# Altium schematic sheet F030K6T6.schdoc
size 309 x 223 mm; Symbol: Sheet-Symbol_A4; Device: Sheet-Symbol_A4; Convert to PCB: yes; Add into BOM: yes; Drawed: timp2100; Reviewed: timp2100; Version: 1.0; @Project Name: F030K6T6; @Page Count: 1; @Update Date: 2022-08-12; @Create Date: 2022-07-31; @Schematic Name: Schematic1; @Page No: 1; @Page Name: P1
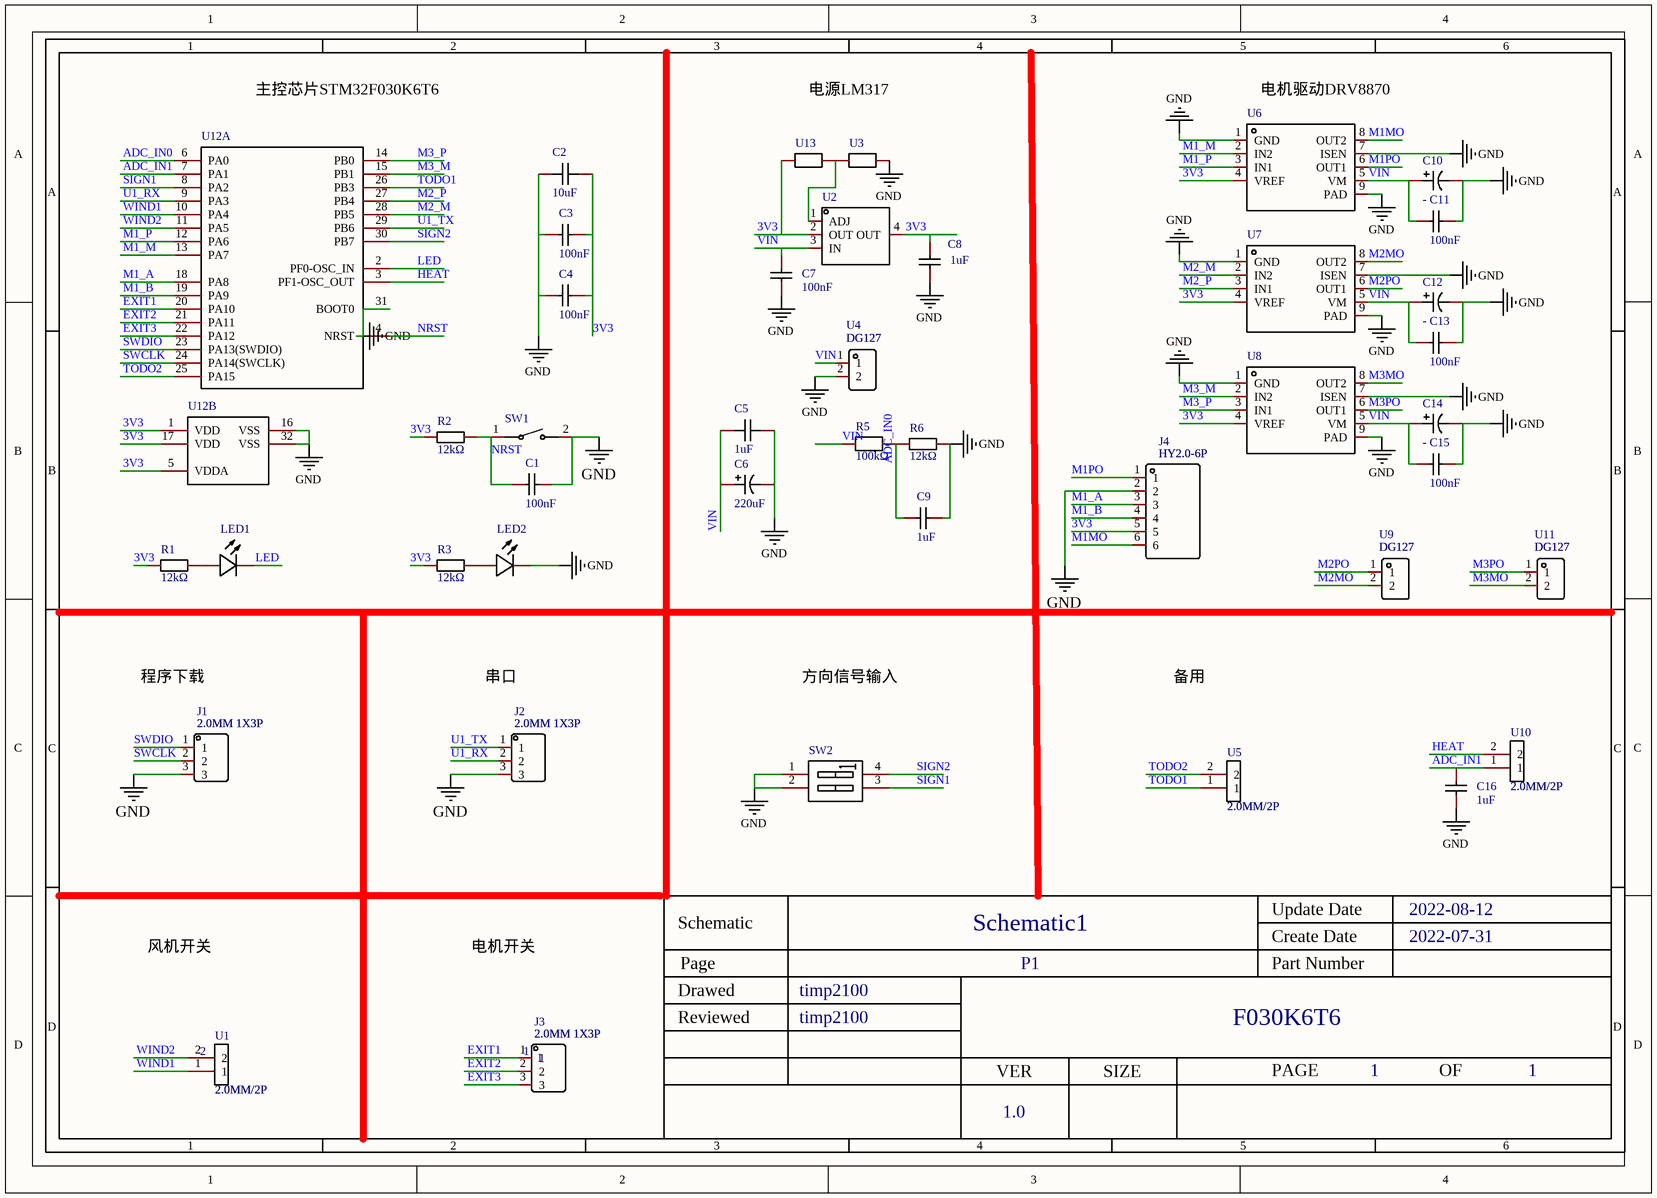
[diagram p0: F030K6T6.schdoc]

## Parts
C1  value 100nF  [C0402]  (hidden comment: 0402F104M500NT)
C2  value 10uF  [C0402]  (hidden comment: GRJ155R60J106ME11D)
C3  value 100nF  [C0402]  (hidden comment: 0402F104M500NT)
C4  value 100nF  [C0402]  (hidden comment: 0402F104M500NT)
C5  value 1uF  [C0603]  (hidden comment: GRT188R61H105KE13D)
C6  value 220uF  [CAP-SMD_BD10.0-L10.3-W10.3-LS11.0-FD]  (hidden comment: RVT220UF50V67RV0021)
C7  value 100nF  [C0402]  (hidden comment: 0402F104M500NT)
C8  value 1uF  [C0402]  (hidden comment: LMK105BJ105KV-F)
C9  value 1uF  [C0402]  (hidden comment: LMK105BJ105KV-F)
C10  XT47UF50V90RV0082  [CAP-SMD_BD6.3-L6.6-W6.6-LS7.3-FD]  (value not drawn)
C11  value 100nF  [C0402]  (hidden comment: 0402F104M500NT)
C12  XT47UF50V90RV0082  [CAP-SMD_BD6.3-L6.6-W6.6-LS7.3-FD]  (value not drawn)
C13  value 100nF  [C0402]  (hidden comment: 0402F104M500NT)
C14  XT47UF50V90RV0082  [CAP-SMD_BD6.3-L6.6-W6.6-LS7.3-FD]  (value not drawn)
C15  value 100nF  [C0402]  (hidden comment: 0402F104M500NT)
C16  value 1uF  [C0402]  (hidden comment: LMK105BJ105KV-F)
J1  2.0MM 1X3P  [2.0MM-1X3P]
J2  2.0MM 1X3P  [2.0MM-1X3P]
J3  2.0MM 1X3P  NAME: 1  [2.0MM-1X3P]
J4  HY2.0-6P  [HY2.0-6P]
LED1  MHT136CRCT  [LED0402-RD]  (value not drawn)
LED2  MHT136CGCT  [LED0402-RD_GREEN]  (value not drawn)
R1  value 12kΩ  [R0402]  (hidden comment: 0402WGJ0123TCE)
R2  value 12kΩ  [R0402]  (hidden comment: 0402WGJ0123TCE)
R3  value 12kΩ  [R0402]  (hidden comment: 0402WGJ0123TCE)
R5  value 100kΩ  [R0402]  (hidden comment: RT0402CRE07100KL)
R6  value 12kΩ  [R0402]  (hidden comment: 0402WGJ0123TCE)
SW1  K2-1107ST-A4DW-06  [KEY-SMD_L6.2-W3.6-LS8.0]  (value not drawn)
SW2  DS-02RP  [SW-TH_DS-02XP]  (value not drawn)
U1  2.0MM/2P  NUMBER: 2  [2.0MM/1*2P]
U2  LM317  [SOT-223-3_L6.5-W3.4-P2.30-LS7.0-BR]  (value not drawn)
U3  SCR0402J20K  [R0402]  (value not drawn)
U4  DG127  [CONN-TH_DG127-5.0-02P-14-1002A-H]
U5  2.0MM/2P  [2.0MM/1*2P]
U6  DRV8870DDAR  [HSOP-8_L5.0-W4.0-P1.27-LS6.2-BL-EP]  (value not drawn)
U7  DRV8870DDAR  [HSOP-8_L5.0-W4.0-P1.27-LS6.2-BL-EP]  (value not drawn)
U8  DRV8870DDAR  [HSOP-8_L5.0-W4.0-P1.27-LS6.2-BL-EP]  (value not drawn)
U9  DG127  [CONN-TH_DG127-5.0-02P-14-1002A-H]
U10  2.0MM/2P  [2.0MM/1*2P]
U11  DG127  [CONN-TH_DG127-5.0-02P-14-1002A-H]
U12  STM32F030K6T6TR  [LQFP-32_L7.0-W7.0-P0.80-LS9.0-TL]  (value not drawn)  (parts A,B of 2)
U13  SCR0402J20K  [R0402]  (value not drawn)

## Nets
GND: C1.2 C2.1 C3.1 C4.1 C5.1 C6.2 C7.1 C8.1 C9.1 C10.2 C11.2 C12.2 C13.2 C14.2 C15.2 C16.2 J1.3 J2.3 J4.2 LED2.1(K) R6.2 SW1.2 SW2.1(A1) SW2.2(A2) U3.2 U4.2 U6.1(GND) U6.7(ISEN) U6.9(PAD) U7.1(GND) U7.7(ISEN) U7.9(PAD) U8.1(GND) U8.7(ISEN) U8.9(PAD) U12.16(VSS) U12.31(BOOT0) U12.32(VSS)
3V3: C2.2 C3.2 C4.2 C8.2 J4.5 R1.1 R2.1 R3.1 U2.2(OUT) U2.4(OUT) U6.4(VREF) U7.4(VREF) U8.4(VREF) U12.1(VDD) U12.5(VDDA) U12.17(VDD) U13.1
ADC_IN0: C9.2 R5.2 R6.1 U12.6(PA0)
ADC_IN1: C16.1 U10.1 U12.7(PA1)
EXIT1: J3.1 U12.20(PA10)
EXIT2: J3.2 U12.21(PA11)
EXIT3: J3.3 U12.22(PA12)
HEAT: U10.2 U12.3(PF1-OSC_OUT)
LED: LED1.1(K) U12.2(PF0-OSC_IN)
M1_A: J4.3 U12.18(PA8)
M1_B: J4.4 U12.19(PA9)
M1_M: U6.2(IN2) U12.13(PA7)
M1_P: U6.3(IN1) U12.12(PA6)
M1MO: J4.6 U6.8(OUT2)
M1PO: J4.1 U6.6(OUT1)
M2_M: U7.2(IN2) U12.28(PB5)
M2_P: U7.3(IN1) U12.27(PB4)
M2MO: U7.8(OUT2) U9.2
M2PO: U7.6(OUT1) U9.1
M3_M: U8.2(IN2) U12.15(PB1)
M3_P: U8.3(IN1) U12.14(PB0)
M3MO: U8.8(OUT2) U11.2
M3PO: U8.6(OUT1) U11.1
NRST: C1.1 R2.2 SW1.1 U12.4(NRST)
SIGN1: SW2.3 U12.8(PA2)
SIGN2: SW2.4 U12.30(PB7)
SWCLK: J1.2 U12.24(PA14(SWCLK))
SWDIO: J1.1 U12.23(PA13(SWDIO))
TODO1: U5.1 U12.26(PB3)
TODO2: U5.2 U12.25(PA15)
U1_RX: J2.2 U12.9(PA3)
U1_TX: J2.1 U12.29(PB6)
VIN: C5.2 C6.1 C7.2 C10.1 C11.1 C12.1 C13.1 C14.1 C15.1 R5.1 U2.3(IN) U4.1 U6.5(VM) U7.5(VM) U8.5(VM)
WIND1: U1.1 U12.10(PA4)
WIND2: U1.2 U12.11(PA5)
NetLED1_2: LED1.2(A) R1.2
NetLED2_2: LED2.2(A) R3.2
NetU2_1: U2.1(ADJ) U3.1 U13.2

## Notes on the sheet
- 主控芯片STM32F030K6T6
- 电源LM317
- (near U6) 电机驱动DRV8870
- 程序下载
- 串口
- 方向信号输入
- 备用
- 风机开关
- 电机开关
- 1
- 2
- 3
- 4
- 5
- 6
- A
- B
- C
- Schematic
- Schematic1
- Create Date
- Update Date
- 2022-08-12
- 2022-07-31
- Reviewed
- Drawed
- Page
- timp2100
- P1
- Part Number
- F030K6T6
- D
- VER
- SIZE
- PAGE
- OF
- 1.0

## Library data of the parts
C1 C3 C4 C7 C11 C13 C15 = 0402F104M500NT: 容值:100nF;精度:±20%;额定电压:50V;温度系数:Y5V;; Manufacturer: FH(风华); Add into BOM: yes; Tolerance: ±20%; Voltage Rated: 50V; Temperature Coefficient: Y5V; Symbol: 0402F104M500NT; Device: 0402F104M500NT; LCSC Part Name: 100nF ±20% 50V; Supplier Part: C1581; Manufacturer Part: 0402F104M500NT; Supplier Footprint: 0402; JLCPCB Part Class: Extended Part; Datasheet: https://atta.szlcsc.com/upload/public/pdf/source/20170923/C1581_1506149281201988388.pdf; Supplier: LCSC; Convert to PCB: yes
C2 = GRJ155R60J106ME11D: 容值:10uF;精度:±20%;额定电压:-;温度系数:-;; Manufacturer: muRata(村田); Add into BOM: yes; Tolerance: ±20%; Symbol: GRJ155R60J106ME11D; Device: GRJ155R60J106ME11D; LCSC Part Name: 10uF ±20%; Supplier Part: C469527; Manufacturer Part: GRJ155R60J106ME11D; Supplier Footprint: 0402; JLCPCB Part Class: Extended Part; Datasheet: https://atta.szlcsc.com/upload/public/pdf/source/20191220/C469527_E196AAF1AD50AACDA035CC5E3D7EDBEE.pdf; Supplier: LCSC; Convert to PCB: yes; Voltage Rated: -; Temperature Coefficient: -
C5 = GRT188R61H105KE13D: 容值:1uF;精度:±10%;额定电压:50V;温度系数:X5R;; Manufacturer: muRata(村田); Add into BOM: yes; Tolerance: ±10%; Voltage Rated: 50V; Temperature Coefficient: X5R; Symbol: GRT188R61H105KE13D; Device: GRT188R61H105KE13D; LCSC Part Name: 1uF ±10% 50V 汽车级; Supplier Part: C126631; Manufacturer Part: GRT188R61H105KE13D; Supplier Footprint: 0603; JLCPCB Part Class: Extended Part; Datasheet: https://atta.szlcsc.com/upload/public/pdf/source/20180228/C126631_15198052675481377102.pdf; Supplier: LCSC; Convert to PCB: yes
C6 = RVT220UF50V67RV0021: 容值:220uF;额定电压:50V;工作寿命:2000hrs@105;; Manufacturer: KNSCHA(科尼盛); Add into BOM: yes; Rated Voltage: 50V; Symbol: RVT220UF50V67RV0021; Device: RVT220UF50V67RV0021; LCSC Part Name: 220uF 50V; Supplier Part: C2887271; Manufacturer Part: RVT220UF50V67RV0021; Supplier Footprint: SMD,10x10.2mm; JLCPCB Part Class: Extended Part; Datasheet: https://atta.szlcsc.com/upload/public/pdf/source/20210824/08E695BB4B7EEB96F38ACC5D13E6017A.pdf; Supplier: LCSC; Convert to PCB: yes; Lifetime @ Temp: 2000hrs@105
C8 C9 C16 = LMK105BJ105KV-F: 容值:1uF;精度:±10%;额定电压:10V;温度系数:X5R;; Manufacturer: TAIYO YUDEN(太诱); Add into BOM: yes; Tolerance: ±10%; Voltage Rated: 10V; Temperature Coefficient: X5R; Symbol: LMK105BJ105KV-F; Device: LMK105BJ105KV-F; LCSC Part Name: 1uF ±10% 10V; Supplier Part: C87145; Manufacturer Part: LMK105BJ105KV-F; Supplier Footprint: 0402; JLCPCB Part Class: Extended Part; Datasheet: https://atta.szlcsc.com/upload/public/pdf/source/20161110/1478747661406.pdf; Supplier: LCSC; Convert to PCB: yes
C10 C12 C14 = XT47UF50V90RV0082: 容值:-;精度:-;额定电压:-;电容体直径:-;电容体长度:-;纹波电流:-;等效串联电阻:-;工作寿命:-;工作温度:-;; Manufacturer: KNSCHA(科尼盛); Add into BOM: yes; Symbol: XT47UF50V90RV0082; Device: XT47UF50V90RV0082; LCSC Part Name: XT47UF50V90RV0082; Supplier Part: C2992613; Manufacturer Part: XT47UF50V90RV0082; Supplier Footprint: SMD,6.3x7.7mm; JLCPCB Part Class: Extended Part; Datasheet: https://atta.szlcsc.com/upload/public/pdf/source/20220414/BED5DAD736BF25221648574B8BBABBD4.pdf; Supplier: LCSC; Convert to PCB: yes; Value: -; Tolerance: -; Rated Voltage: -; φD: -; L: -; Ripple Current: -; Equivalent Series Resistance(ESR): -; Lifetime @ Temp: -; Operating Temperature: -
J1-J3 = 2.0MM 1X3P: Add into BOM: yes; Name: 2.0MM 1X3P; Symbol: 2.0MM 1X3P; Device: 2.0MM 1X3P; Convert to PCB: yes; Origin Footprint: 2.0MM-1X3P
  J3: NUMBER: 1
J4 = HY2.0-6P: Add into BOM: yes; Name: HY2.0-6P; Symbol: HY2.0-6P; Device: HY2.0-6P; Convert to PCB: yes; Origin Footprint: HY2.0-6P
LED1 = MHT136CRCT: 发光颜色:红灯;二极管配置:-;透镜颜色:无色透明;主波长:617.5nm~633.5nm;峰值波长:632nm;色温:-;光通量(25时):-;测试电流:5mA;正向电压(VF):1.9V;发光强度:36mcd;功率:60mW;发光角度:120°;安装方式:-;工作温度:-35~+85;; Manufacturer: MEIHUA(美华科技); Add into BOM: yes; Emitted Color: 红灯; Lens Color: 无色透明; Peak Wavelength: 632nm; Forward Current: 5mA; Forward Voltage (VF): 1.9V; Luminous Intensity: 36mcd; Power Dissipation: 60mW; Viewing Angle: 120°; Symbol: MHT136CRCT; Device: MHT136CRCT; LCSC Part Name: LED贴片0402高亮红色光; Supplier Part: C401111; Manufacturer Part: MHT136CRCT; Supplier Footprint: 0402; JLCPCB Part Class: Extended Part; Datasheet: https://atta.szlcsc.com/upload/public/pdf/source/20190613/C397045_F2F0F7EAC495BEB23889A615F1EA2291.pdf; Supplier: LCSC; Convert to PCB: yes; Diode Configuration: -; Dominant Wavelength: 617.5nm~633.5nm; Color Temperature: -; Luminous Flux (@25℃): -; Mounting Sytle: -; Operating Temperature: -35~+85
LED2 = MHT136CGCT: 发光颜色:普绿/黄绿;二极管配置:-;透镜颜色:无色透明;主波长:565.5nm~573.5nm;峰值波长:575nm;色温:-;光通量(25时):-;测试电流:5mA;正向电压(VF):1.9V;发光强度:18mcd;功率:60mW;发光角度:120°;安装方式:-;工作温度:-35~+85;; Manufacturer: MEIHUA(美华科技); Add into BOM: yes; Emitted Color: 普绿/黄绿; Lens Color: 无色透明; Peak Wavelength: 575nm; Forward Current: 5mA; Forward Voltage (VF): 1.9V; Luminous Intensity: 18mcd; Power Dissipation: 60mW; Viewing Angle: 120°; Symbol: MHT136CGCT; Device: MHT136CGCT; LCSC Part Name: LED贴片0402高亮黄绿色光; Supplier Part: C401111; Manufacturer Part: MHT136CGCT; Supplier Footprint: 0402; JLCPCB Part Class: Extended Part; Datasheet: https://atta.szlcsc.com/upload/public/pdf/source/20190702/C401111_0A840381EC33404C0049AF0EC9B7006C.pdf; Supplier: LCSC; Convert to PCB: yes; Diode Configuration: -; Dominant Wavelength: 565.5nm~573.5nm; Color Temperature: -; Luminous Flux (@25℃): -; Mounting Sytle: -; Operating Temperature: -35~+85
R1-R3 R6 = 0402WGJ0123TCE: 电阻类型:厚膜电阻;阻值:12kΩ;精度:±5%;功率:1/16W;温度系数:±100ppm/;最大工作电压:50V;工作温度范围:-55~+155;; Manufacturer: UNI-ROYAL(厚声); Add into BOM: yes; Tolerance: ±5%; Power(Watts): 1/16W; Overload Voltage (Max): 50V; Symbol: 0402WGJ0123TCE; Device: 0402WGJ0123TCE; LCSC Part Name: 12kΩ ±5%; Supplier Part: C25535; Manufacturer Part: 0402WGJ0123TCE; Supplier Footprint: 0402; JLCPCB Part Class: Extended Part; Datasheet: https://atta.szlcsc.com/upload/public/pdf/source/20200306/C422600_1E6D84923E4A46A82E41ADD87F860B5C.pdf; Supplier: LCSC; Convert to PCB: yes; Type: 厚膜电阻; Temperature Coefficient: ±100ppm/; Operating Temperature Range: -55~+155
R5 = RT0402CRE07100KL: 电阻类型:薄膜电阻;阻值:100kΩ;精度:±0.25%;功率:62.5mW;温度系数:±50ppm/;最大工作电压:50V;工作温度范围:-55~+155;; Manufacturer: YAGEO(国巨); Add into BOM: yes; Tolerance: ±0.25%; Power(Watts): 62.5mW; Temperature Coefficient: ±50ppm/; Overload Voltage (Max): 50V; Symbol: RT0402CRE07100KL; Device: RT0402CRE07100KL; LCSC Part Name: 100kΩ ±0.25%; Supplier Part: C705662; Manufacturer Part: RT0402CRE07100KL; Supplier Footprint: 0402; JLCPCB Part Class: Extended Part; Datasheet: https://atta.szlcsc.com/upload/public/pdf/source/20200720/C705662_425923491B4425CE43C3F76874C49D6C.pdf; Supplier: LCSC; Convert to PCB: yes; Type: 薄膜电阻; Operating Temperature Range: -55~+155
SW1 = K2-1107ST-A4DW-06: 触点电流:50mA;额定电压(DC):12V;绝缘电阻:100MΩ;电路结构:单刀单掷;安装方式:立贴;按钮形状:矩形按钮;带灯:-;作用力:250gf@±30gf;机械寿命:100000;工作温度:-25~+85;开关长度:6.1mm;开关宽度:3.6mm;开关高度:2.5mm;; Manufacturer: 韩国韩荣; Symbol: K2-1107ST-A4SW-06; Add into BOM: yes; Contact Current: 50mA; Voltage Rating (DC): 12V; Insulation Resistance: 100MΩ; Circuit: 单刀单掷; Actuator Style: 矩形按钮; Mechanical Life: 100000; Switch Length: 6.1mm; Switch Width: 3.6mm; Switch Height: 2.5mm; Device: K2-1107ST-A4DW-06; LCSC Part Name: 轻触开关 3.6*6.1*2.5; Supplier Part: C118141; Manufacturer Part: K2-1107ST-A4DW-06; Supplier Footprint: SMD; JLCPCB Part Class: Extended Part; Datasheet: https://atta.szlcsc.com/upload/public/pdf/source/20210810/381712CEF248770C072B585C3485C888.pdf; Supplier: LCSC; Convert to PCB: yes; Mounting Style: 立贴; With Lamp: -; Operating Force: 250gf@±30gf; Operating Temperature: -25~+85
SW2 = DS-02RP: 类型:平拨，凸起式;额定电流:25mA;额定电压:24V;电路结构:单刀单掷;开关位数:2;引脚间距:2.54mm;工作温度:-20~+70;使用寿命:3000;颜色:红色;; Manufacturer: 韩国韩荣; Add into BOM: yes; Current Rating: 25mA; Voltage Rating: 24V; Circuit: 单刀单掷; Number of Positions: 2; Operating Life: 3000; Symbol: DS-02RP; Device: DS-02RP; LCSC Part Name: 红色2PIN-2.54mm立式直插正拨拨码开关; Supplier Part: C92646; Manufacturer Part: DS-02RP; Supplier Footprint: 插件; JLCPCB Part Class: Extended Part; Datasheet: https://atta.szlcsc.com/upload/public/pdf/source/20210810/ECF2F28B1CE673E7F9581E27682BDB10.pdf; Supplier: LCSC; Convert to PCB: yes; Type: 平拨，凸起式; Lead Pitch: 2.54mm; Operating Temperature: -20~+70; Color: 红色
U1 U5 U10 = 2.0MM/2P: Add into BOM: yes; Name: 2.0MM/2P; Symbol: 2.0MM/2P; Device: 2.0MM/2P; Convert to PCB: yes; Origin Footprint: 2.0MM/1*2P
U2 = LM317: 输出类型:可调;输出极性:正;输出通道数:1;最大输入电压:40V;输出电压:1.2V~37V;压差:5V@(500mA);输出电流:1.5A;; Manufacturer: CJ（江苏长电/长晶）; Symbol: LM317_C84244; Add into BOM: yes; Output Type: 可调; Output Polarity: 正; Number of Outputs: 1; Maximum Input Voltage: 40V; Output Current: 1.5A; Device: LM317; LCSC Part Name: Vin=40V Vout=1.2V~37V 1.5A; Supplier Part: C84244; Manufacturer Part: LM317; Supplier Footprint: SOT-223; JLCPCB Part Class: Extended Part; Datasheet: https://atta.szlcsc.com/upload/public/pdf/source/20161024/1477288622773.pdf; Supplier: LCSC; Convert to PCB: yes; Output Voltage: 1.2V~37V; Dropout Voltage: 5V@(500mA)
U3 U13 = SCR0402J20K: Manufacturer: VO(翔胜); Add into BOM: yes; Symbol: SCR0402J20K; Device: SCR0402J20K; LCSC Part Name: ±5% 20K; Supplier Part: C3017501; Manufacturer Part: SCR0402J20K; Supplier Footprint: 0402; JLCPCB Part Class: Extended Part; Datasheet: https://atta.szlcsc.com/upload/public/pdf/source/20220513/247AF9639BA21CF93567DC289CCC6A22.pdf; Supplier: LCSC; Convert to PCB: yes
U4 U9 U11 = DG127-5.0-02P-14-1002A(H): Manufacturer: DEGSON; Paste Type: expand; Add into BOM: yes; Name: DG127; Symbol: DG127-5.0-02P-14-1002A(H); Device: DG127-5.0-02P-14-1002A(H); link: https://item.szlcsc.com/699546.html?ref=editor&logined=true; 3DModel: CONN-TH_DG127-5.0-02P-14-1002A-H; Supplier: LCSC; Supplier Part: C669322; Manufacturer Part: DG127-5.0-02P-14-1002A(H); Convert to PCB: yes; Origin Footprint: CONN-TH_DG127-5.0-02P-14-1002A-H
U6-U8 = DRV8870DDAR: DRV8870 DRV8870 预售; Manufacturer: TI(德州仪器); Add into BOM: yes; Symbol: DRV8870DDAR; Device: DRV8870DDAR; LCSC Part Name: DRV8870DDAR; Supplier Part: C86590; Manufacturer Part: DRV8870DDAR; Supplier Footprint: HSOP-8; JLCPCB Part Class: Extended Part; Datasheet: https://atta.szlcsc.com/upload/public/pdf/source/20170908/C86590_1504870130414958090.pdf; Supplier: LCSC; Convert to PCB: yes
U12 = STM32F030K6T6TR: CPU位数:-;ROM类型:-;CPU内核:-;主频（MAX):-;工作电压:-;; Manufacturer: ST(意法半导体); Add into BOM: yes; Symbol: STM32F030K6T6TR; Device: STM32F030K6T6TR; LCSC Part Name: STM32F030K6T6TR; Supplier Part: C88446; Manufacturer Part: STM32F030K6T6TR; Supplier Footprint: LQFP-32; JLCPCB Part Class: Extended Part; Datasheet: https://atta.szlcsc.com/upload/public/pdf/source/20190902/C106925_4C89CDEE905DCB71B11CF5798678D860.pdf; Supplier: LCSC; Convert to PCB: yes; Core Size: -; Program Memory Type: -; Core Processor: -; Speed: -; Voltage - Supply (Vcc/Vdd): -; Program Memory Size: -; RAM Size: -; EEPROM Size: -; Number of I/O: -; A/D: -; D/A: -; PWM: -; LCD: -; UART/USART: -; SPI: -; I2C（SMBUS/PMBUS）: -; USB Device: -; USB Host/OTG: -; CAN: -; Ethernet: -; Features: -